# Altium project MEC.PrjPcb (part 1 of 2)
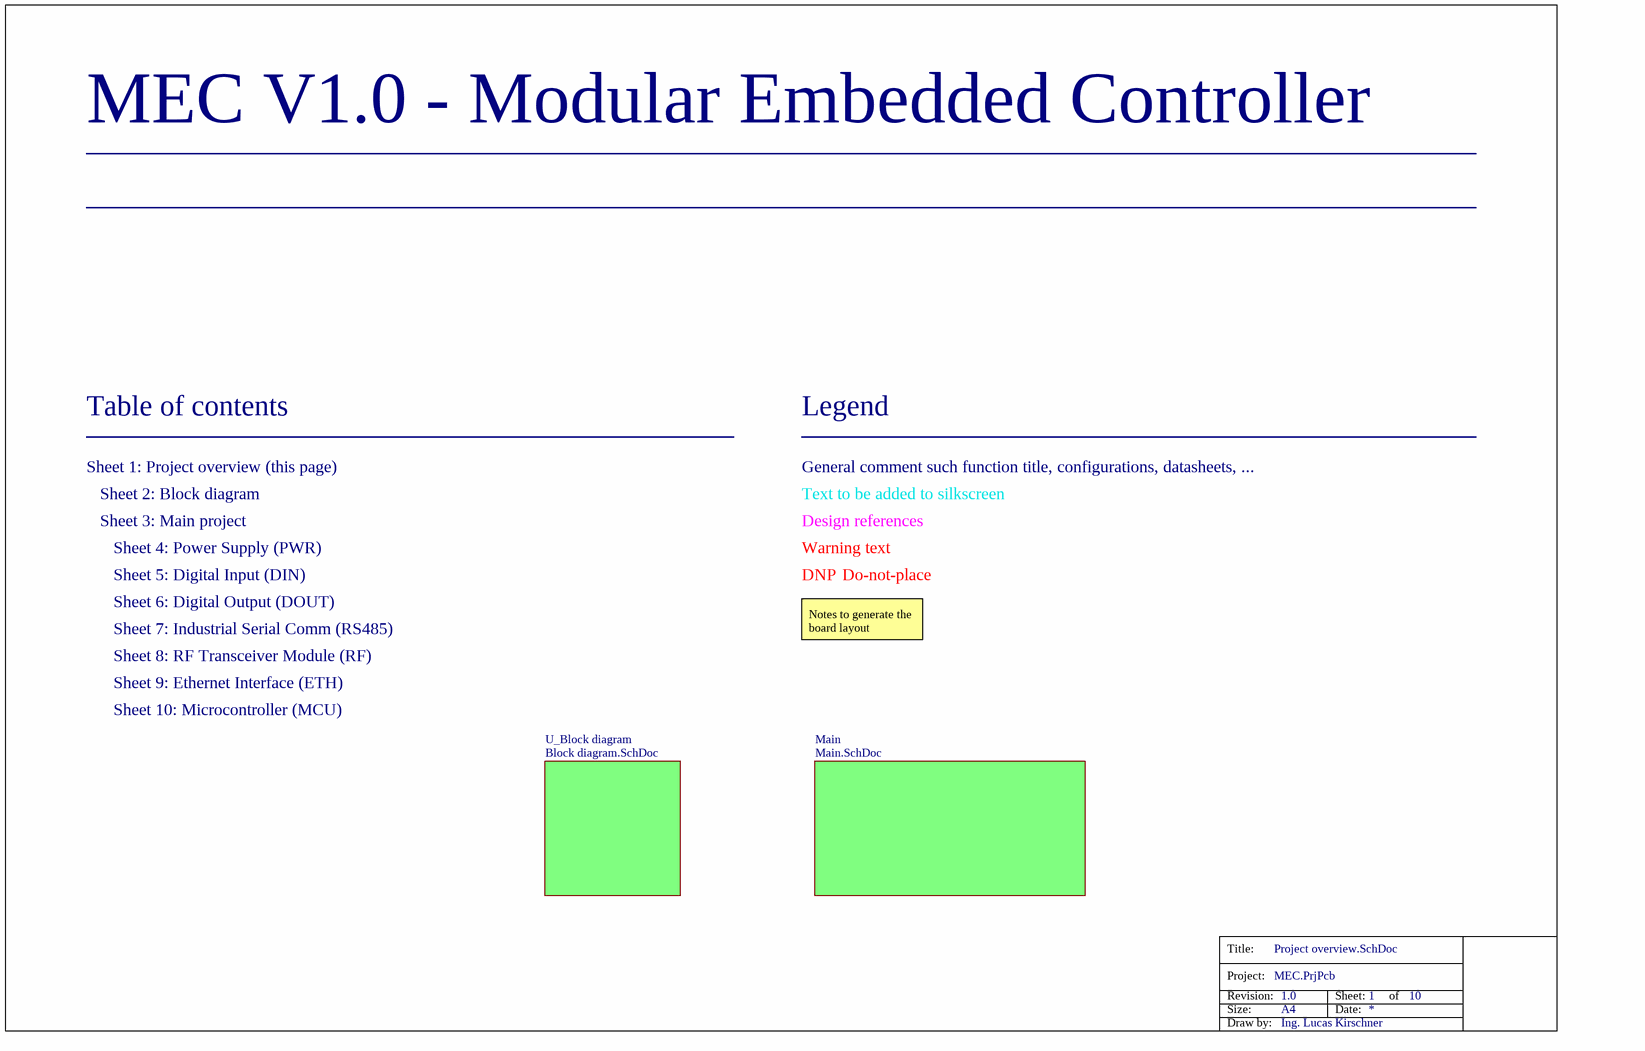
[diagram p0: Project overview.SchDoc]
Author: Ing. Lucas Kirschner; Company: Ing. Prodol; Version: 1.0
10 sheets, 240 parts. Net scope: flat (ports and power ports of the same name join across sheets).
Board file: PCB.PcbDoc
Sheets:
  Project overview.SchDoc
    Main = Main.SchDoc
      U_Microcontroller (MCU) = Microcontroller (MCU).SchDoc
      U_Digital Input (DIN) = Digital Input (DIN).SchDoc
      U_Digital Output (DOUT) = Digital Output (DOUT).SchDoc
      U_Ethernet Interface (ETH) = Ethernet Interface (ETH).SchDoc
      U_Power Supply (PWR) = Power Supply (PWR).SchDoc
      U_Industrial Serial Comm (RS485) = Industrial Serial Comm (RS485).SchDoc
      U_RF Transceiver Module (RF) = RF Transceiver Module (RF).SchDoc
    U_Block diagram = Block diagram.SchDoc

## Sheet Project overview.SchDoc
size A4; SheetNumber: 1; SheetTotal: 10

### Sub-sheets
Main = Main.SchDoc: no entries
U_Block diagram = Block diagram.SchDoc: no entries

### Notes on the sheet
- MEC V1.0 - Modular Embedded Controller
- Table of contents
- Legend
- Sheet 1: Project overview (this page)
- Sheet 2: Block diagram
- General comment such function title, configurations, datasheets, ...
- Text to be added to silkscreen
- Sheet 3: Main project
- Sheet 5: Digital Input (DIN)
- Sheet 4: Power Supply (PWR)
- Warning text
- DNP
- Design references
- Do-not-place
- Sheet 6: Digital Output (DOUT)
- Sheet 7: Industrial Serial Comm (RS485)
- Notes to generate the board layout
- Sheet 8: RF Transceiver Module (RF)
- Sheet 10: Microcontroller (MCU)
- Sheet 9: Ethernet Interface (ETH)
- Title:
- Project:
- Revision:
- Size:
- Draw by:
- A4
- Sheet:
- Date:
- of

## Sheet Main.SchDoc
size A4; SheetNumber: 3; SheetTotal: 10
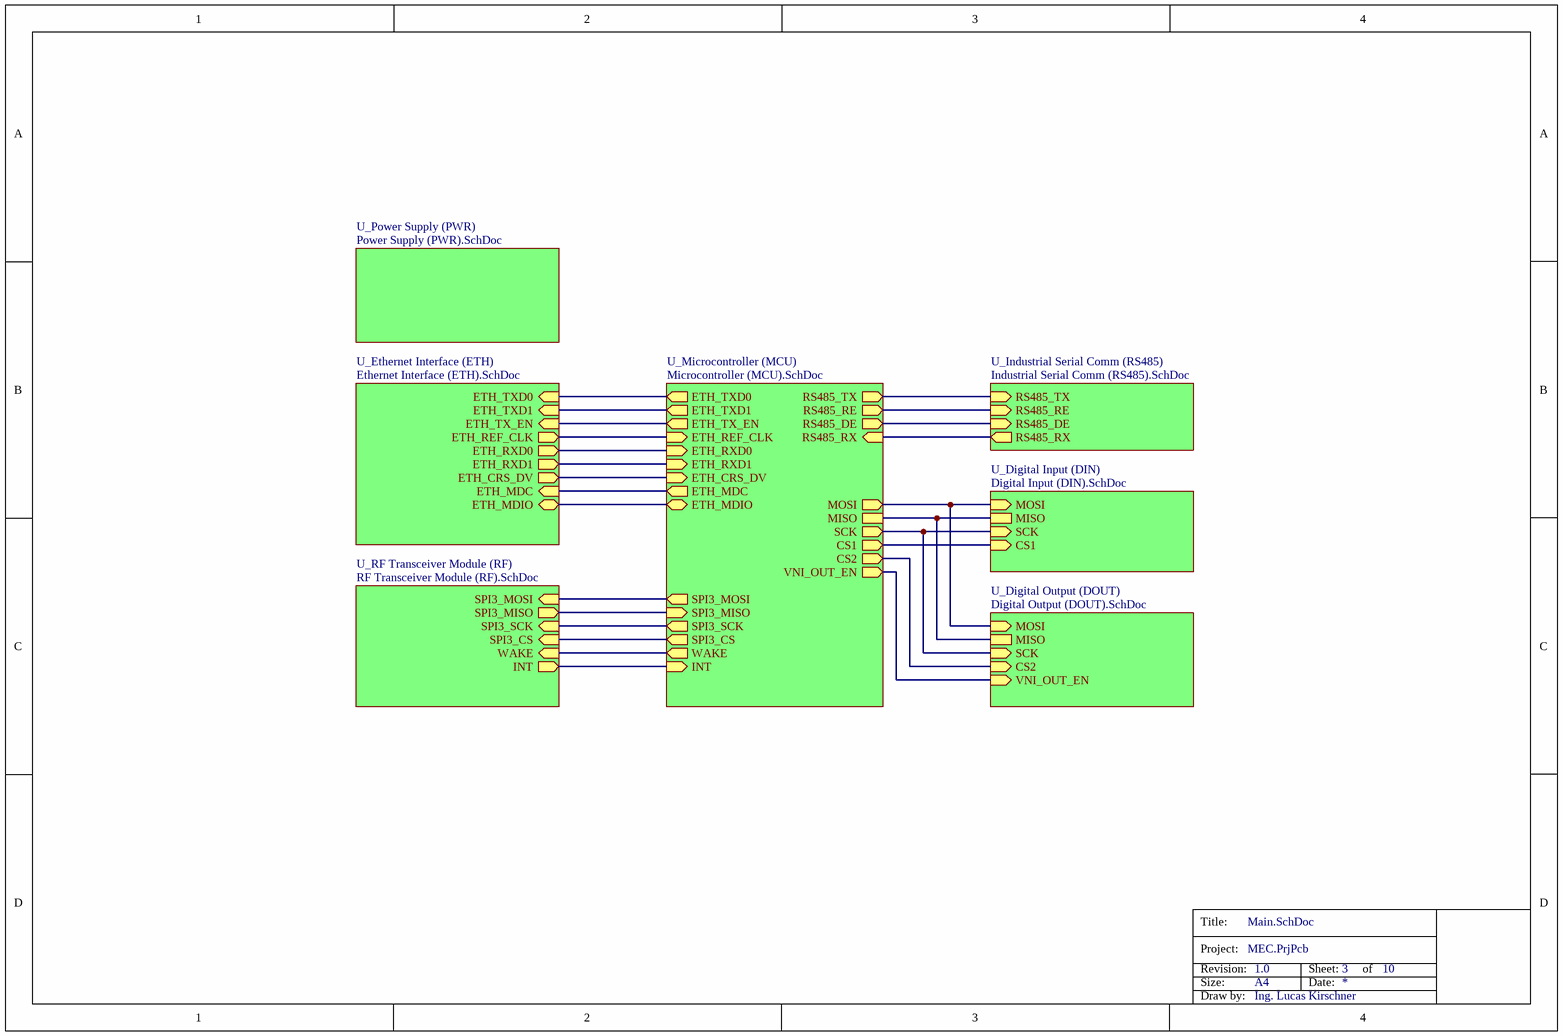
[diagram p1: Main.SchDoc]

### Sub-sheets
U_Digital Input (DIN) = Digital Input (DIN).SchDoc: MOSI (in), SCK (in), CS1 (in), MISO
U_Digital Output (DOUT) = Digital Output (DOUT).SchDoc: VNI_OUT_EN (in), MOSI (in), SCK (in), CS2 (in), MISO
U_Ethernet Interface (ETH) = Ethernet Interface (ETH).SchDoc: ETH_REF_CLK (out), ETH_RXD1 (out), ETH_RXD0 (out), ETH_MDIO (bidir), ETH_MDC (in), ETH_TXD1 (in), ETH_TXD0 (in), ETH_TX_EN (in), ETH_CRS_DV (out)
U_Industrial Serial Comm (RS485) = Industrial Serial Comm (RS485).SchDoc: RS485_TX (in), RS485_RX (out), RS485_RE (in), RS485_DE (in)
U_Microcontroller (MCU) = Microcontroller (MCU).SchDoc: ETH_REF_CLK (in), ETH_RXD1 (in), ETH_RXD0 (in), ETH_MDIO (bidir), ETH_MDC (out), ETH_TXD1 (out), ETH_TXD0 (out), ETH_TX_EN (out), ETH_CRS_DV (in), RS485_RX (in), RS485_TX (out), SPI3_CS (out), SPI3_SCK (out), SPI3_MISO (in), SPI3_MOSI (out), MOSI (out), SCK (out), CS1 (out), MISO, CS2 (out), VNI_OUT_EN (out), INT (in), RS485_RE (out), RS485_DE (out), WAKE (out)
U_Power Supply (PWR) = Power Supply (PWR).SchDoc: no entries
U_RF Transceiver Module (RF) = RF Transceiver Module (RF).SchDoc: SPI3_CS (in), SPI3_SCK (in), SPI3_MISO (out), SPI3_MOSI (in), INT (out), WAKE (in)

### Nets
(unnamed): sheet U_Microcontroller (MCU)/ETH_REF_CLK, sheet U_Ethernet Interface (ETH)/ETH_REF_CLK
(unnamed): sheet U_Microcontroller (MCU)/ETH_RXD1, sheet U_Ethernet Interface (ETH)/ETH_RXD1
(unnamed): sheet U_Microcontroller (MCU)/ETH_RXD0, sheet U_Ethernet Interface (ETH)/ETH_RXD0
(unnamed): sheet U_Microcontroller (MCU)/ETH_MDIO, sheet U_Ethernet Interface (ETH)/ETH_MDIO
(unnamed): sheet U_Microcontroller (MCU)/ETH_MDC, sheet U_Ethernet Interface (ETH)/ETH_MDC
(unnamed): sheet U_Microcontroller (MCU)/ETH_TXD1, sheet U_Ethernet Interface (ETH)/ETH_TXD1
(unnamed): sheet U_Microcontroller (MCU)/ETH_TXD0, sheet U_Ethernet Interface (ETH)/ETH_TXD0
(unnamed): sheet U_Microcontroller (MCU)/ETH_TX_EN, sheet U_Ethernet Interface (ETH)/ETH_TX_EN
(unnamed): sheet U_Microcontroller (MCU)/ETH_CRS_DV, sheet U_Ethernet Interface (ETH)/ETH_CRS_DV
(unnamed): sheet U_Microcontroller (MCU)/RS485_RX, sheet U_Industrial Serial Comm (RS485)/RS485_RX
(unnamed): sheet U_Microcontroller (MCU)/RS485_TX, sheet U_Industrial Serial Comm (RS485)/RS485_TX
(unnamed): sheet U_Microcontroller (MCU)/SPI3_CS, sheet U_RF Transceiver Module (RF)/SPI3_CS
(unnamed): sheet U_Microcontroller (MCU)/SPI3_SCK, sheet U_RF Transceiver Module (RF)/SPI3_SCK
(unnamed): sheet U_Microcontroller (MCU)/SPI3_MISO, sheet U_RF Transceiver Module (RF)/SPI3_MISO
(unnamed): sheet U_Microcontroller (MCU)/SPI3_MOSI, sheet U_RF Transceiver Module (RF)/SPI3_MOSI
(unnamed): sheet U_Microcontroller (MCU)/MOSI, sheet U_Digital Input (DIN)/MOSI, sheet U_Digital Output (DOUT)/MOSI
(unnamed): sheet U_Microcontroller (MCU)/SCK, sheet U_Digital Input (DIN)/SCK, sheet U_Digital Output (DOUT)/SCK
(unnamed): sheet U_Microcontroller (MCU)/CS1, sheet U_Digital Input (DIN)/CS1
(unnamed): sheet U_Microcontroller (MCU)/MISO, sheet U_Digital Input (DIN)/MISO, sheet U_Digital Output (DOUT)/MISO
(unnamed): sheet U_Microcontroller (MCU)/CS2, sheet U_Digital Output (DOUT)/CS2
(unnamed): sheet U_Microcontroller (MCU)/VNI_OUT_EN, sheet U_Digital Output (DOUT)/VNI_OUT_EN
(unnamed): sheet U_Microcontroller (MCU)/INT, sheet U_RF Transceiver Module (RF)/INT
(unnamed): sheet U_Microcontroller (MCU)/RS485_RE, sheet U_Industrial Serial Comm (RS485)/RS485_RE
(unnamed): sheet U_Microcontroller (MCU)/RS485_DE, sheet U_Industrial Serial Comm (RS485)/RS485_DE
(unnamed): sheet U_Microcontroller (MCU)/WAKE, sheet U_RF Transceiver Module (RF)/WAKE

### Notes on the sheet
- Title:
- Project:
- Revision:
- Size:
- A4
- Sheet:
- Date:
- of
- Draw by:

## Sheet Microcontroller (MCU).SchDoc
size A4; SheetNumber: 10; SheetTotal: 10
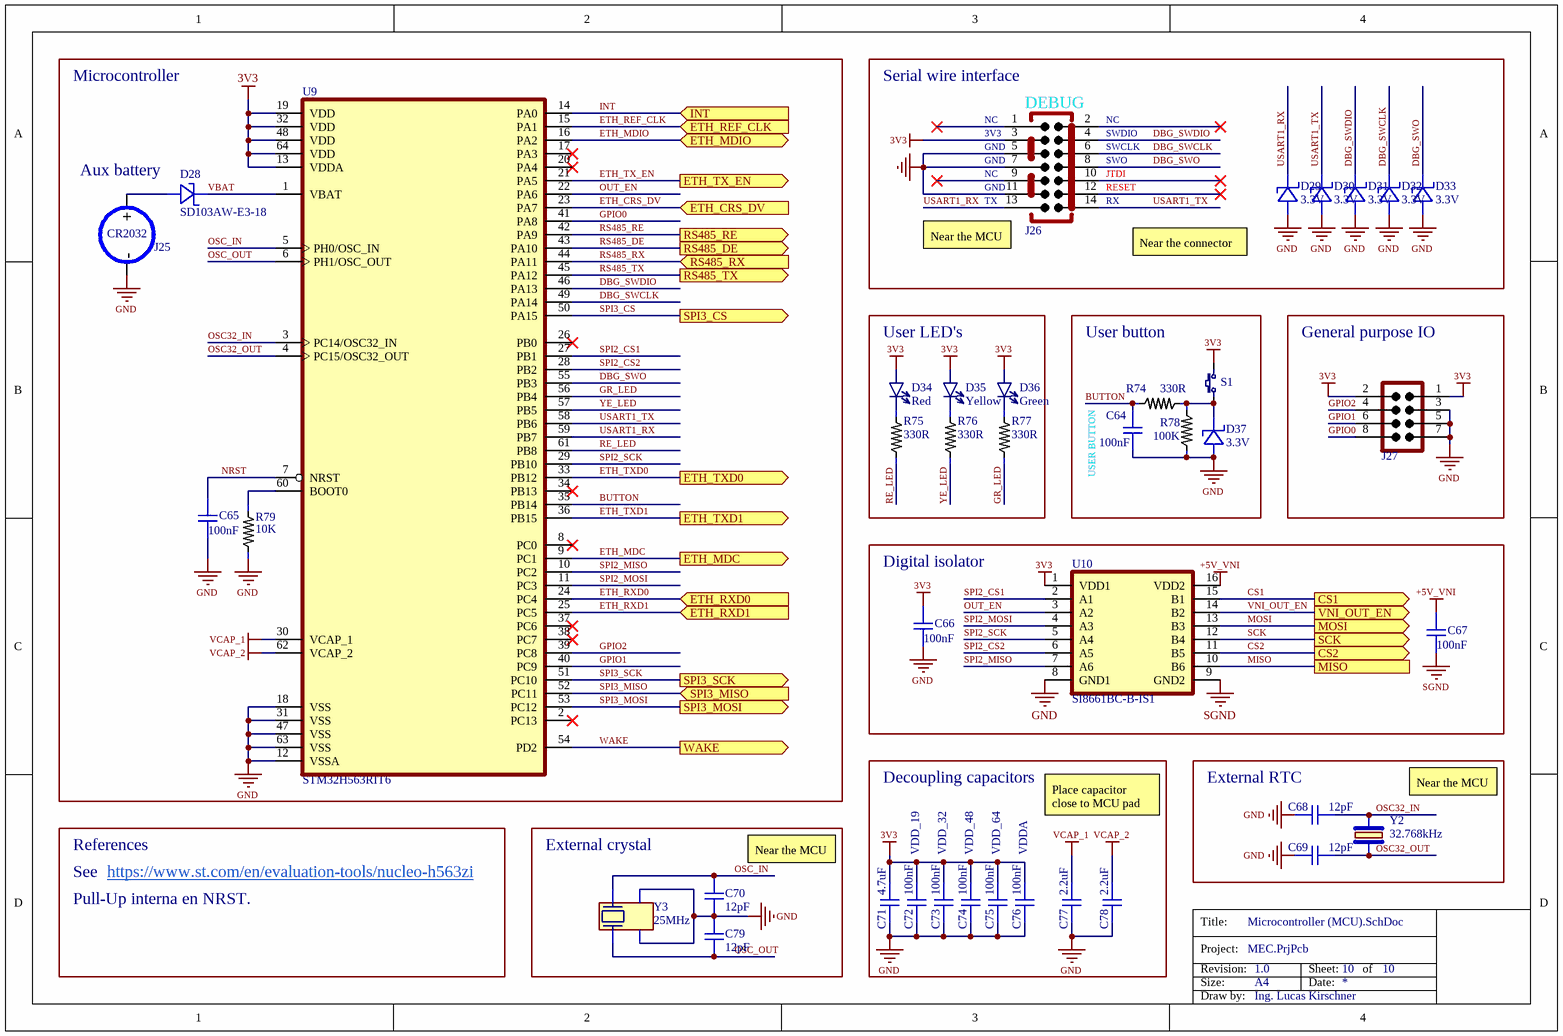
[diagram p2: Microcontroller (MCU).SchDoc]

### Parts
C64  value 100nF  [CAPC1005N]  (hidden comment: Multilayer Ceramic Capacitors)
C65  value 100nF  [CAPC1005N]  (hidden comment: Multilayer Ceramic Capacitors)
C66  value 100nF  [CAPC1005N]  (hidden comment: Multilayer Ceramic Capacitors)
C67  value 100nF  [CAPC1005N]  (hidden comment: Multilayer Ceramic Capacitors)
C68  value 12pF  [CAPC1005N]  (hidden comment: Multilayer Ceramic Capacitors)
C69  value 12pF  [CAPC1005N]  (hidden comment: Multilayer Ceramic Capacitors)
C70  value 12pF  [CAPC1005N]  (hidden comment: Multilayer Ceramic Capacitors)
C71  value 4.7uF  [CAPC1005N]  (hidden comment: Multilayer Ceramic Capacitors)
C72  value 100nF  [CAPC1005N]  (hidden comment: Multilayer Ceramic Capacitors)
C73  value 100nF  [CAPC1005N]  (hidden comment: Multilayer Ceramic Capacitors)
C74  value 100nF  [CAPC1005N]  (hidden comment: Multilayer Ceramic Capacitors)
C75  value 100nF  [CAPC1005N]  (hidden comment: Multilayer Ceramic Capacitors)
C76  value 100nF  [CAPC1005N]  (hidden comment: Multilayer Ceramic Capacitors)
C77  value 2.2uF  [CAPC1005N]  (hidden comment: Multilayer Ceramic Capacitors)
C78  value 2.2uF  [CAPC1005N]  (hidden comment: Multilayer Ceramic Capacitors)
C79  value 12pF  [CAPC1005N]  (hidden comment: Multilayer Ceramic Capacitors)
D28  Part Number: SD103AW-E3-18  [SOD3705X110-2N]  (hidden comment: Schottky Diodes)
D29  value 3.3V  [SOD2512X110N]  (hidden comment: ESD Protection Diodes)
D30  value 3.3V  [SOD2512X110N]  (hidden comment: ESD Protection Diodes)
D31  value 3.3V  [SOD2512X110N]  (hidden comment: ESD Protection Diodes)
D32  value 3.3V  [SOD2512X110N]  (hidden comment: ESD Protection Diodes)
D33  value 3.3V  [SOD2512X110N]  (hidden comment: ESD Protection Diodes)
D34  value Red  [LEDC1608X80N_RED]  (hidden comment: Single Color LED)
D35  value Yellow  [LEDC1608X80N_YELLOW]  (hidden comment: Single Color LED)
D36  value Green  [LEDC1608X80N_GREEN]  (hidden comment: Single Color LED)
D37  value 3.3V  [SOD2512X110N]  (hidden comment: ESD Protection Diodes)
J25  Cell Battery Holders  [CONB_BH_CR2032-2N]  (value not drawn)
J26  Male straight header  [CONH_ML127P-14N]  (value not drawn)
J27  Male straight header  [CONH_ML254P-SMT-8N]  (value not drawn)
R74  value 330R  [RESC1005N]  (hidden comment: Thick Film Resistors)
R75  value 330R  [RESC1005N]  (hidden comment: Thick Film Resistors)
R76  value 330R  [RESC1005N]  (hidden comment: Thick Film Resistors)
R77  value 330R  [RESC1005N]  (hidden comment: Thick Film Resistors)
R78  value 100K  [RESC1005N]  (hidden comment: Thick Film Resistors)
R79  value 10K  [RESC1005N]  (hidden comment: Thick Film Resistors)
S1  Tactile Switches  [PKG3.5X6-2N]  (value not drawn)
U9  Part Number: STM32H563RIT6  [QFP50P1200X1200X160-64N]  (hidden comment: ARM Cortex M33 MCU)
U10  Part Number: SI8661BC-B-IS1  [SOIC127P1030X265-16N]  (hidden comment: Digital Isolators)
Y2  value 32.768kHz  [XTAL3215]  (hidden comment: Crystal)
Y3  value 25MHz  [XTAL3225]  (hidden comment: Crystal)

### Blocks framed on the sheet
User LED's: D34-D36 R75-R77
User button: C64 D37 R74 R78 S1
General purpose IO: J27
Digital isolator: C66 C67 U10
Decoupling capacitors: C71-C78
External RTC: C68 C69 Y2
External crystal: C70 C79 Y3

### Ports
CS1 (out, see Main[3C], Digital Input (DIN)[1C]), CS2 (out, see Main[3C], Digital Output (DOUT)[1C]), ETH_CRS_DV (in, see Main[2B], Ethernet Interface (ETH)[2B]), ETH_MDC (out, see Main[2B], Ethernet Interface (ETH)[2B]), ETH_MDIO (bidir, see Main[2B], Ethernet Interface (ETH)[2B]), ETH_REF_CLK (in, see Main[2B], Ethernet Interface (ETH)[2B]), ETH_RXD0 (in, see Main[2B], Ethernet Interface (ETH)[2B]), ETH_RXD1 (in, see Main[2B], Ethernet Interface (ETH)[2B]), ETH_TX_EN (out, see Main[2B], Ethernet Interface (ETH)[2B]), ETH_TXD0 (out, see Main[2B], Ethernet Interface (ETH)[2A]), ETH_TXD1 (out, see Main[2B], Ethernet Interface (ETH)[2B]), INT (in, see Main[2C], RF Transceiver Module (RF)[1B]), MISO (see Main[3C], Digital Input (DIN)[1C], Digital Output (DOUT)[1C]), MOSI (out, see Main[3B], Digital Input (DIN)[1C], Digital Output (DOUT)[1C]), RS485_DE (out, see Main[3B], Industrial Serial Comm (RS485)[1B]), RS485_RE (out, see Main[3B], Industrial Serial Comm (RS485)[1B]), RS485_RX (in, see Main[3B], Industrial Serial Comm (RS485)[1B]), RS485_TX (out, see Main[3B], Industrial Serial Comm (RS485)[1B]), SCK (out, see Main[3C], Digital Input (DIN)[1C], Digital Output (DOUT)[1C]), SPI3_CS (out, see Main[2C], RF Transceiver Module (RF)[2B]), SPI3_MISO (in, see Main[2C], RF Transceiver Module (RF)[2B]), SPI3_MOSI (out, see Main[2C], RF Transceiver Module (RF)[1B]), SPI3_SCK (out, see Main[2C], RF Transceiver Module (RF)[1B]), VNI_OUT_EN (out, see Main[3C], Digital Output (DOUT)[2B]), WAKE (out, see Main[2C], RF Transceiver Module (RF)[1B])

### Nets
3V3: C66.1 C71.1 C72.1 C73.1 C74.1 C75.1 C76.1 D34.A D35.A D36.A J26.3 J27.1 J27.2 S1.2 U9.13(VDDA) U9.19(VDD) U9.32(VDD) U9.48(VDD) U9.64(VDD) U10.1(VDD1)
+5V_VNI: C67.1 U10.16(VDD2)
GND: C64.2 C65.2 C66.2 C68.2 C69.2 C70.2 C71.2 C72.2 C73.2 C74.2 C75.2 C76.2 C77.2 C78.2 C79.1 D29.A D30.A D31.A D32.A D33.A D37.A J25.1(-) J26.5 J26.7 J26.11 J27.3 J27.5 J27.7 R78.1 R79.1 U9.12(VSSA) U9.18(VSS) U9.31(VSS) U9.47(VSS) U9.63(VSS) U10.8(GND1) Y3.2(GND) Y3.4(GND)
SGND: C67.2 U10.9(GND2)
VCAP_1: C77.1 U9.30(VCAP_1)
VCAP_2: C78.1 U9.62(VCAP_2)
BUTTON: C64.1 R74.1 U9.35(PB14)
CS1: U10.15(B1) ; port CS1
CS2: U10.11(B5) ; port CS2
DBG_SWCLK: D32.C J26.6 U9.49(PA14)
DBG_SWDIO: D31.C J26.4 U9.46(PA13)
DBG_SWO: D33.C J26.8 U9.55(PB3)
ETH_CRS_DV: U9.23(PA7) ; port ETH_CRS_DV
ETH_MDC: U9.9(PC1) ; port ETH_MDC
ETH_MDIO: U9.16(PA2) ; port ETH_MDIO
ETH_REF_CLK: U9.15(PA1) ; port ETH_REF_CLK
ETH_RXD0: U9.24(PC4) ; port ETH_RXD0
ETH_RXD1: U9.25(PC5) ; port ETH_RXD1
ETH_TX_EN: U9.21(PA5) ; port ETH_TX_EN
ETH_TXD0: U9.33(PB12) ; port ETH_TXD0
ETH_TXD1: U9.36(PB15) ; port ETH_TXD1
GPIO0: J27.8 U9.41(PA8)
GPIO1: J27.6 U9.40(PC9)
GPIO2: J27.4 U9.39(PC8)
GR_LED: R77.1 U9.56(PB4)
INT: U9.14(PA0) ; port INT
MISO: U10.10(B6) ; port MISO
MOSI: U10.13(B3) ; port MOSI
NRST: C65.1 U9.7(NRST)
OSC32_IN: C68.1 U9.3(PC14/OSC32_IN) Y2.2(CRYSTAL)
OSC32_OUT: C69.1 U9.4(PC15/OSC32_OUT) Y2.1(CRYSTAL)
OSC_IN: C70.1 U9.5(PH0/OSC_IN) Y3.1(IN/OUT)
OSC_OUT: C79.2 U9.6(PH1/OSC_OUT) Y3.3(OUT/IN)
OUT_EN: U9.22(PA6) U10.3(A2)
RE_LED: R75.1 U9.61(PB8)
RS485_DE: U9.43(PA10) ; port RS485_DE
RS485_RE: U9.42(PA9) ; port RS485_RE
RS485_RX: U9.44(PA11) ; port RS485_RX
RS485_TX: U9.45(PA12) ; port RS485_TX
SCK: U10.12(B4) ; port SCK
SPI2_CS1: U9.27(PB1) U10.2(A1)
SPI2_CS2: U9.28(PB2) U10.6(A5)
SPI2_MISO: U9.10(PC2) U10.7(A6)
SPI2_MOSI: U9.11(PC3) U10.4(A3)
SPI2_SCK: U9.29(PB10) U10.5(A4)
SPI3_CS: U9.50(PA15) ; port SPI3_CS
SPI3_MISO: U9.52(PC11) ; port SPI3_MISO
SPI3_MOSI: U9.53(PC12) ; port SPI3_MOSI
SPI3_SCK: U9.51(PC10) ; port SPI3_SCK
USART1_RX: D29.C J26.13 U9.59(PB7)
USART1_TX: D30.C J26.14 U9.58(PB6)
VBAT: D28.C U9.1(VBAT)
VNI_OUT_EN: U10.14(B2) ; port VNI_OUT_EN
WAKE: U9.54(PD2) ; port WAKE
YE_LED: R76.1 U9.57(PB5)
NetD28_A: D28.A J25.2(+)
NetD34_C: D34.C R75.2
NetD35_C: D35.C R76.2
NetD36_C: D36.C R77.2
NetD37_C: D37.C R74.2 R78.2 S1.1
NetR79_2: R79.2 U9.60(BOOT0)

Not connected (* = marked no-connect by the designer): J26 1* 2* 9* 10* 12*; U9 2(PC13)* 8(PC0)* 17(PA3)* 20(PA4)* 26(PB0)* 34(PB13)* 37(PC6)* 38(PC7)*

### Notes on the sheet
- Microcontroller
- (near J26) Serial wire interface
- (near J26) DEBUG
- Aux battery
- (near J26) NC
- (near J26) GND
- (near J26) 3V3
- (near J26) SWO
- (near J26) SWCLK
- (near J26) SWDIO
- (near J26) JTDI
- (near J26) Near the MCU
- (near J26) TX
- (near J26) RX
- (near J26) RESET
- Near the connector
- USER BUTTON
- (near Y2) Near the MCU
- References
- VDD_19
- VDD_32
- VDD_48
- VDD_64
- VDDA
- Place capacitor close to MCU pad
- See
- Pull-Up interna en NRST.
- https://www.st.com/en/evaluation-tools/nucleo-h563zi
- Near the MCU
- Title:
- Project:
- Revision:
- Size:
- A4
- Sheet:
- Date:
- of
- Draw by:
- (in symbol J-CR2032-H-SMT) CR2032

### Library data of the parts
C64-C67 C72-C76 = C-MLCC-100nF-50V-10%-0402: Multilayer Ceramic Capacitors MLCC - SMD/SMT 50 V 0.1uF X7R 0402 10%; Part Number: CC0402KRX5R9BB104; Manufacturer: YAGEO; Mounting Type: SMT; Mouser Part #: 603-CC402KRX5R9BB104; Digikey Part #: 311-3342-1-ND; JLCPCB Part #: C105882
C68-C70 C79 = C-MLCC-12pF-50V-10%-0402: Multilayer Ceramic Capacitors MLCC - SMD/SMT 50 V 12 pF C0G 0402 1%; Part Number: CC0402FRNPO9BN120; Manufacturer: YAGEO; Mounting Type: SMT; Mouser Part #: 603-CC402FRNPO9BN120; Digikey Part #: 311-1641-1-ND; JLCPCB Part #: C326662
C71 = C-MLCC-4.7uF-10V-10%-0402: Multilayer Ceramic Capacitors MLCC - SMD/SMT 10V 4.7uF X5R 0402 10% HI CV; Part Number: CC0402KRX5R6BB475; Manufacturer: YAGEO; Mounting Type: SMT; Mouser Part #: 603-CC0402KR5R6BB475; Digikey Part #: 13-CC0402KRX5R6BB475CT-ND; JLCPCB Part #: C326586
C77 C78 = C-MLCC-2.2uF-25V-10%-0402: Multilayer Ceramic Capacitors MLCC - SMD/SMT 25V 2.2uF X5R 0402 10% HI CV; Part Number: CC0402KRX5R8BB225; Manufacturer: YAGEO; Mounting Type: SMT; Mouser Part #: 603-CC0402KRX5R8B225; Digikey Part #: 13-CC0402KRX5R8BB225CT-ND; JLCPCB Part #: C723363
D28 = D-SCH-350mA-40V-SOD123: Schottky Diodes & Rectifiers 350mA 40V SOD123; Manufacturer: Vishay Semiconductors; Mounting Type: SMT; Mouser Part #: 78-SD103AW-E3-18; Digikey Part #: SD103AW-E3-18CT-ND; JLCPCB Part #: C181204
D29-D33 D37 = D-TVS-36W-3.3V-SOD323: ESD Protection Diodes / TVS Diodes UNIDIRECTIONAL 3.3V ESD PR; Manufacturer: onsemi; Part Number: ESD7351HT1G; Mounting Type: SMT; Mouser Part #: 863-ESD7351HT1G; Digikey Part #: ESD7351HT1GOSCT-ND; JLCPCB Part #: C19829399
D34 = D-LED-RED-2V-20mA-0603: Standard Single Color LEDs 0603 Red; Part Number: LTST-C190KRKT; Manufacturer: LITEON; Mounting Type: SMT; Mouser Part #: 859-LTST-C190KRKT; Digikey Part #: 160-1436-1-ND; JLCPCB Part #: C94869
D35 = D-LED-YELLOW-2V-20mA-0603: Standard Single Color LEDs 0603 Yellow; Part Number: LTST-C190KSKT; Manufacturer: LITEON; Mounting Type: SMT; Mouser Part #: 859-LTST-C190KSKT; Digikey Part #: 160-1437-1-ND; JLCPCB Part #: C125095
D36 = D-LED-GREEN-2V-20mA-0603: Standard Single Color LEDs 0603 Green; Part Number: LTST-C190KGKT; Manufacturer: LITEON; Mounting Type: SMT; Mouser Part #: 859-LTST-C190KGKT; Digikey Part #: 160-1435-1-ND; JLCPCB Part #: C125094
J25 = J-CR2032-H-SMT: Coin Cell Battery Holders CR2032; Part Number: 1061; Manufacturer: Keystone Electronics; Mounting Type: SMT; Mouser Part #: 534-1061; Digikey Part #: 36-1061-ND; JLCPCB Part #: C238070
J26 = J-14-1P27-HDR-M-SH-SMT: Male straight header, 2 row, 14 positions, 1.27mm pitch, SMD; Manufacturer: SAMTEC; Part Number: FTSH-107-01-F-DV-K; Mounting Type: SMT; Mouser Part #: 200-FTSH10701FDVK; Digikey Part #: 612-FTSH-107-01-F-DV-K-ND; JLCPCB Part #: C7465995
J27 = J-8-2P54-HDR-M-VERT-SMT: Male straight header, 2 row, 8 positions, 2.54mm pitch, SMD; Part Number: 95278-101-08LF; Manufacturer: Amphenol FCI; Mounting Type: SMT; Mouser Part #: 649-95278-101-08LF; Digikey Part #: 609-5752-ND; JLCPCB Part #: C192300
R74-R77 = R-THICK-330R-62.5mW-1%-0402: Thick Film Resistors - SMD General Purpose Chip Resistor 0402, 330Ohms, 1%, 1/16W; Part Number: RC0402FR-07330RL; Manufacturer: YAGEO; Mounting Type: SMT; Mouser Part #: 603-RC0402FR-07330RL; Digikey Part #: 311-330LRCT-ND; JLCPCB Part #: C105875
R78 = R-THICK-100K-62.5mW-1%-0402: Thick Film Resistors - SMD General Purpose Chip Resistor 0402, 100kOhms, 1%, 1/16W; Part Number: RC0402FR-07100KL; Manufacturer: YAGEO; Mounting Type: SMT; Mouser Part #: 603-RC0402FR-07100KL; Digikey Part #: 311-100KLRCT-ND; JLCPCB Part #: C60491
R79 = R-THICK-10K-62.5mW-1%-0402: Thick Film Resistors - SMD General Purpose Chip Resistor 0402, 10kOhms, 1%, 1/16W; Part Number: RC0402FR-0710KL; Manufacturer: YAGEO; Mounting Type: SMT; Mouser Part #: 603-RC0402FR-0710KL; Digikey Part #: 311-10.0KLRCT-ND; JLCPCB Part #: C60490
S1 = S-TACT-NO-6x3.5-SMT: Tactile Switches SMD OFF - (ON); Manufacturer: TE Connectivity; Part Number: FSMSM; Mounting Type: SMT; Mouser Part #: 506-FSMSM; Digikey Part #: 450-1140-ND; JLCPCB Part #: C3012022
U9 = U-STM32H563RI: ARM Microcontrollers - MCU Arm Cortex-M33 32-bit 250 MHz 2 Mbytes Flash 640KB RAM I3C, DCMI, Ethernet, SMPS; Manufacturer: STMicroelectronics; Mounting Type: SMT; Mouser Part #: 511-STM32H563RIT6; Digikey Part #: 497-STM32H563RIT6-ND; JLCPCB Part #: C20619634
U10 = U-SI8661BC-B-IS1: Digital Isolators 3.75 kV 5 forward & 1 reverse 6-channel isolator; Manufacturer: Skyworks; Mounting Type: SMT; Mouser Part #: 634-SI8661BC-B-IS1; Digikey Part #: 336-2120-5-ND; JLCPCB Part #: C528656
Y2 = Y-XTAL-32.768kHz-12pF-20ppm-3215-SMT: Crystals 32.768KHz 20ppm 12.5pF -40C +85C; Part Number: ECS-.327-12.5-34B-TR; Manufacturer: ECS; Mounting Type: SMT; Mouser Part #: 520-327-12.5-34B; Digikey Part #: 50-ECS-.327-12.5-34B-TRCT-ND; JLCPCB Part #: C32346
Y3 = Y-XTAL-25MHz-12pF-20ppm-3225-SMT: Crystals 25MHz 12pF 20ppm -40C +125C; Manufacturer: ECS; Part Number: ECS-250-12-33Q-JES-TR; Mounting Type: SMT; Mouser Part #: 520-250-12-33Q-JEST; Digikey Part #: XC2151CT-ND; JLCPCB Part #: C91750

## Sheet Digital Input (DIN).SchDoc
size A4; SheetNumber: 5; SheetTotal: 10
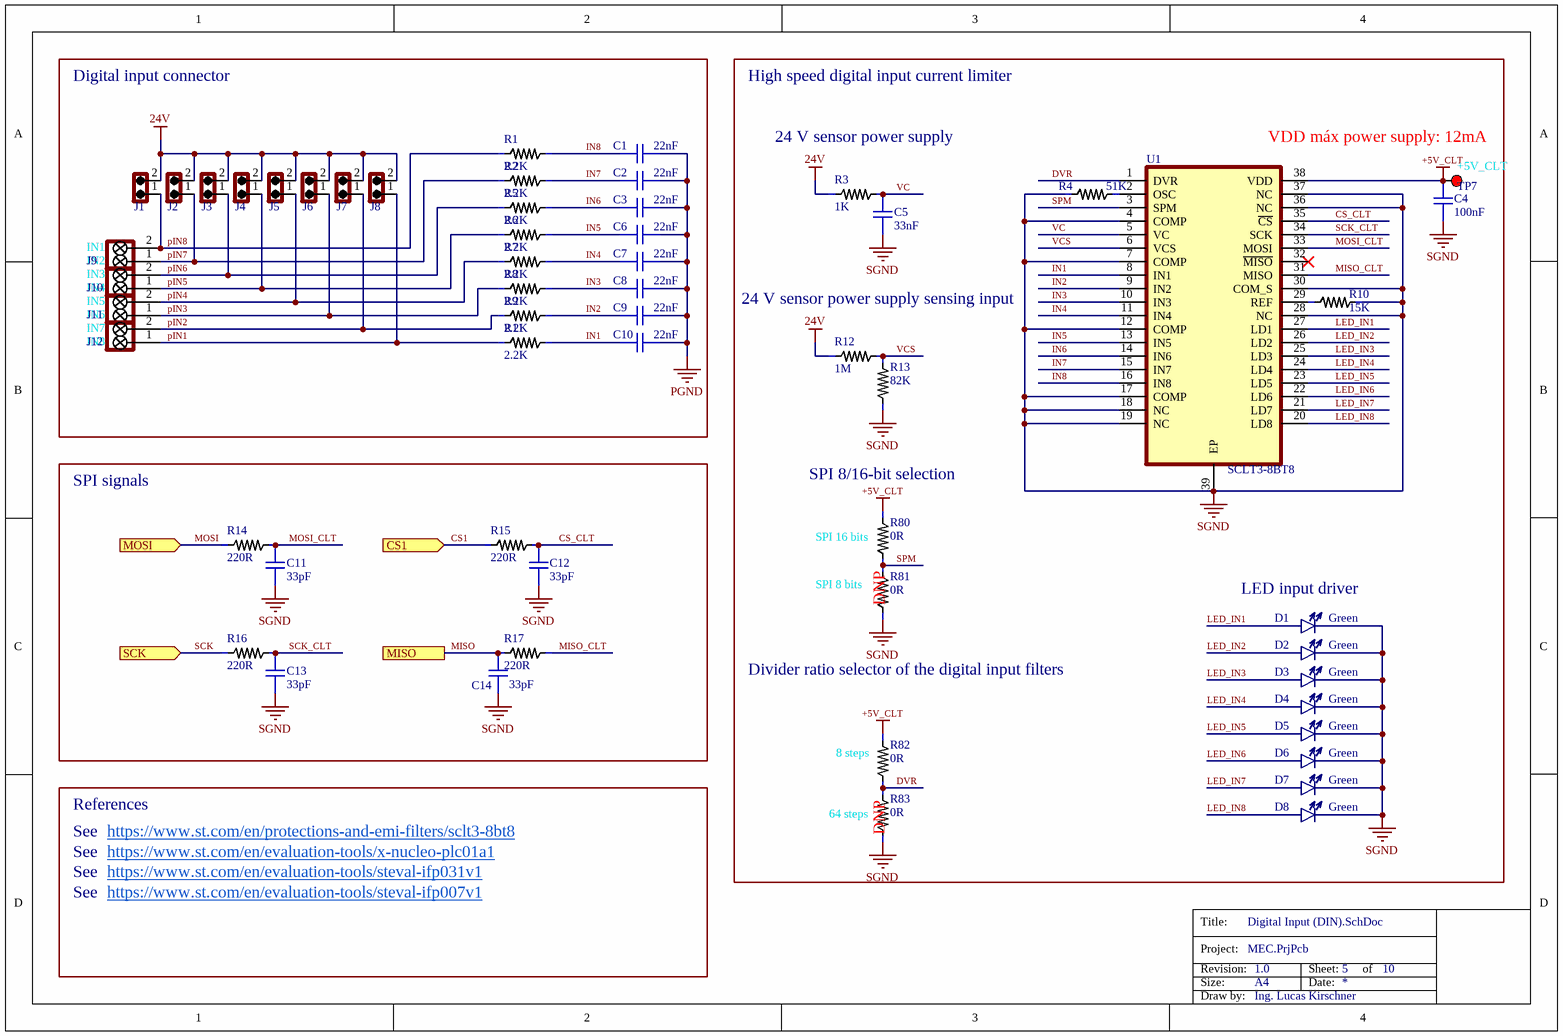
[diagram p3: Digital Input (DIN).SchDoc]

### Parts
C1  value 22nF  [CAPC2012N]  (hidden comment: Multilayer Ceramic Capacitors)
C2  value 22nF  [CAPC2012N]  (hidden comment: Multilayer Ceramic Capacitors)
C3  value 22nF  [CAPC2012N]  (hidden comment: Multilayer Ceramic Capacitors)
C4  value 100nF  [CAPC1005N]  (hidden comment: Multilayer Ceramic Capacitors)
C5  value 33nF  [CAPC2012N]  (hidden comment: Multilayer Ceramic Capacitors)
C6  value 22nF  [CAPC2012N]  (hidden comment: Multilayer Ceramic Capacitors)
C7  value 22nF  [CAPC2012N]  (hidden comment: Multilayer Ceramic Capacitors)
C8  value 22nF  [CAPC2012N]  (hidden comment: Multilayer Ceramic Capacitors)
C9  value 22nF  [CAPC2012N]  (hidden comment: Multilayer Ceramic Capacitors)
C10  value 22nF  [CAPC2012N]  (hidden comment: Multilayer Ceramic Capacitors)
C11  value 33pF  [CAPC1005N]  (hidden comment: Multilayer Ceramic Capacitors)
C12  value 33pF  [CAPC1005N]  (hidden comment: Multilayer Ceramic Capacitors)
C13  value 33pF  [CAPC1005N]  (hidden comment: Multilayer Ceramic Capacitors)
C14  value 33pF  [CAPC1005N]  (hidden comment: Multilayer Ceramic Capacitors)
D1  value Green  [LEDC1608X80N_GREEN]  (hidden comment: Single Color LED)
D2  value Green  [LEDC1608X80N_GREEN]  (hidden comment: Single Color LED)
D3  value Green  [LEDC1608X80N_GREEN]  (hidden comment: Single Color LED)
D4  value Green  [LEDC1608X80N_GREEN]  (hidden comment: Single Color LED)
D5  value Green  [LEDC1608X80N_GREEN]  (hidden comment: Single Color LED)
D6  value Green  [LEDC1608X80N_GREEN]  (hidden comment: Single Color LED)
D7  value Green  [LEDC1608X80N_GREEN]  (hidden comment: Single Color LED)
D8  value Green  [LEDC1608X80N_GREEN]  (hidden comment: Single Color LED)
J1  Male straight header  [CONH_ML254P-2N]  (value not drawn)
J2  Male straight header  [CONH_ML254P-2N]  (value not drawn)
J3  Male straight header  [CONH_ML254P-2N]  (value not drawn)
J4  Male straight header  [CONH_ML254P-2N]  (value not drawn)
J5  Male straight header  [CONH_ML254P-2N]  (value not drawn)
J6  Male straight header  [CONH_ML254P-2N]  (value not drawn)
J7  Male straight header  [CONH_ML254P-2N]  (value not drawn)
J8  Male straight header  [CONH_ML254P-2N]  (value not drawn)
J9  Terminal Blocks  [CONB_FIX508P-2N]  (value not drawn)
J10  Terminal Blocks  [CONB_FIX508P-2N]  (value not drawn)
J11  Terminal Blocks  [CONB_FIX508P-2N]  (value not drawn)
J12  Terminal Blocks  [CONB_FIX508P-2N]  (value not drawn)
R1  value 2.2K  [RESC2012N]  (hidden comment: Thick Film Resistors)
R2  value 2.2K  [RESC2012N]  (hidden comment: Thick Film Resistors)
R3  value 1K  [RESC2012N]  (hidden comment: Thick Film Resistors)
R4  value 51K  [RESC1005N]  (hidden comment: Thick Film Resistors)
R5  value 2.2K  [RESC2012N]  (hidden comment: Thick Film Resistors)
R6  value 2.2K  [RESC2012N]  (hidden comment: Thick Film Resistors)
R7  value 2.2K  [RESC2012N]  (hidden comment: Thick Film Resistors)
R8  value 2.2K  [RESC2012N]  (hidden comment: Thick Film Resistors)
R9  value 2.2K  [RESC2012N]  (hidden comment: Thick Film Resistors)
R10  value 15K  [RESC1005N]  (hidden comment: Thick Film Resistors)
R11  value 2.2K  [RESC2012N]  (hidden comment: Thick Film Resistors)
R12  value 1M  [RESC2012N]  (hidden comment: Thick Film Resistors)
R13  value 82K  [RESC2012N]  (hidden comment: Thick Film Resistors)
R14  value 220R  [RESC1005N]  (hidden comment: Thick Film Resistors)
R15  value 220R  [RESC1005N]  (hidden comment: Thick Film Resistors)
R16  value 220R  [RESC1005N]  (hidden comment: Thick Film Resistors)
R17  value 220R  [RESC1005N]  (hidden comment: Thick Film Resistors)
R80  value 0R  [RESC1005N]  (hidden comment: Thick Film Resistors)
R81  value 0R  [RESC1005N]  (hidden comment: Thick Film Resistors)  (no BOM)
R82  value 0R  [RESC1005N]  (hidden comment: Thick Film Resistors)
R83  value 0R  [RESC1005N]  (hidden comment: Thick Film Resistors)  (no BOM)
TP7  Test point  [TP-1MM]  (value not drawn)  (no BOM)
U1  Part Number: SCLT3-8BT8  [SOP50P640X110-39N]  (hidden comment: I/O Controller Interface)

### Blocks framed on the sheet
Digital input connector: C1-C3 C6-C10 J1-J12 R1 R2 R5-R9 R11
SPI signals: C11-C14 R14-R17

### Ports
CS1 (in, see Main[3C], Microcontroller (MCU)[4C]), MISO (see Main[3C], Digital Output (DOUT)[1C], Microcontroller (MCU)[4C]), MOSI (in, see Main[3B], Digital Output (DOUT)[1C], Microcontroller (MCU)[4C]), SCK (in, see Main[3C], Digital Output (DOUT)[1C], Microcontroller (MCU)[4C])

### Nets
24V: J1.2 J2.2 J3.2 J4.2 J5.2 J6.2 J7.2 J8.2 R3.1 R12.1
+5V_CLT: C4.1 R80.2 R82.2 TP7.1 U1.38(VDD)
PGND: C1.2 C2.2 C3.2 C6.2 C7.2 C8.2 C9.2 C10.2
SGND: C4.2 C5.2 C11.2 C12.2 C13.2 C14.2 D1.C D2.C D3.C D4.C D5.C D6.C D7.C D8.C R4.1 R10.2 R13.1 R81.1 R83.1 U1.4(COMP) U1.7(COMP) U1.12(COMP) U1.17(COMP) U1.18(NC) U1.19(NC) U1.28(NC) U1.30(COM_S) U1.36(NC) U1.37(NC) U1.39(EP)
CS1: R15.1 ; port CS1
CS_CLT: C12.1 R15.2 U1.35(~{CS})
DVR: R82.1 R83.2 U1.1(DVR)
IN1: C10.1 R11.2 U1.8(IN1)
IN2: C9.1 R9.2 U1.9(IN2)
IN3: C8.1 R8.2 U1.10(IN3)
IN4: C7.1 R7.2 U1.11(IN4)
IN5: C6.1 R6.2 U1.13(IN5)
IN6: C3.1 R5.2 U1.14(IN6)
IN7: C2.1 R2.2 U1.15(IN7)
IN8: C1.1 R1.2 U1.16(IN8)
LED_IN1: D1.A U1.27(LD1)
LED_IN2: D2.A U1.26(LD2)
LED_IN3: D3.A U1.25(LD3)
LED_IN4: D4.A U1.24(LD4)
LED_IN5: D5.A U1.23(LD5)
LED_IN6: D6.A U1.22(LD6)
LED_IN7: D7.A U1.21(LD7)
LED_IN8: D8.A U1.20(LD8)
MISO: C14.1 R17.1 ; port MISO
MISO_CLT: R17.2 U1.31(MISO)
MOSI: R14.1 ; port MOSI
MOSI_CLT: C11.1 R14.2 U1.33(MOSI)
pIN1: J8.1 J12.1 R11.1
pIN2: J7.1 J12.2 R9.1
pIN3: J6.1 J11.1 R8.1
pIN4: J5.1 J11.2 R7.1
pIN5: J4.1 J10.1 R6.1
pIN6: J3.1 J10.2 R5.1
pIN7: J2.1 J9.1 R2.1
pIN8: J1.1 J9.2 R1.1
SCK: R16.1 ; port SCK
SCK_CLT: C13.1 R16.2 U1.34(SCK)
SPM: R80.1 R81.2 U1.3(SPM)
VC: C5.1 R3.2 U1.5(VC)
VCS: R12.2 R13.2 U1.6(VCS)
NetR4_2: R4.2 U1.2(OSC)
NetR10_1: R10.1 U1.29(REF)

Not connected (* = marked no-connect by the designer): U1 32(~{MISO})*

### Notes on the sheet
- High speed digital input current limiter
- 24 V sensor power supply
- VDD máx power supply: 12mA
- (near TP7) +5V_CLT
- IN1
- IN2
- IN3
- IN4
- IN5
- 24 V sensor power supply sensing input
- IN6
- IN7
- IN8
- (near R80) SPI 8/16-bit selection
- (near R80) SPI 16 bits
- (near R81) SPI 8 bits
- (near R81) DNP
- (near D1) LED input driver
- Divider ratio selector of the digital input filters
- (near R82) 8 steps
- References
- See
- https://www.st.com/en/protections-and-emi-filters/sclt3-8bt8
- (near R83) 64 steps
- (near R83) DNP
- https://www.st.com/en/evaluation-tools/x-nucleo-plc01a1
- https://www.st.com/en/evaluation-tools/steval-ifp031v1
- https://www.st.com/en/evaluation-tools/steval-ifp007v1
- Title:
- Project:
- Revision:
- Size:
- A4
- Sheet:
- Date:
- of
- Draw by:

### Library data of the parts
C1-C3 C6-C10 = C-MLCC-22nF-100V-10%-0805: Multilayer Ceramic Capacitors MLCC - SMD/SMT 100 V 0.022 uF X7R 0805 10%; Part Number: CC0805KRX7R0BB223; Manufacturer: YAGEO; Mounting Type: SMT; Mouser Part #: 603-CC805KRX7R0BB223; Digikey Part #: 311-1473-1-ND; JLCPCB Part #: C107137
C4 = C-MLCC-100nF-50V-10%-0402: as C64 on sheet Microcontroller (MCU); Mounting Type: SMT; Mouser Part #: 603-CC402KRX5R9BB104; Digikey Part #: 311-3342-1-ND; JLCPCB Part #: C105882
C5 = C-MLCC-33nF-100V-10%-0805: Multilayer Ceramic Capacitors MLCC - SMD/SMT 100 V 0.033 uF X7R 0805 10%; Part Number: CC0805KKX7R0BB333; Manufacturer: YAGEO; Mounting Type: SMT; Mouser Part #: 603-CC805KKX7R0BB333; Digikey Part #: 311-1875-1-ND; JLCPCB Part #: C327114
C11-C14 = C-MLCC-33pF-50V-10%-0402: Multilayer Ceramic Capacitors MLCC - SMD/SMT 50 V 33 pF C0G 0402 1%; Part Number: CC0402KRNPO9BN330; Manufacturer: YAGEO; Mounting Type: SMT; Mouser Part #: 603-CC0402KRNP9BN330; Digikey Part #: 13-CC0402KRNPO9BN330CT-ND; JLCPCB Part #: C107005
D1-D8 = D-LED-GREEN-2V-20mA-0603: as D36 on sheet Microcontroller (MCU); Mounting Type: SMT; Mouser Part #: 859-LTST-C190KGKT; Digikey Part #: 160-1435-1-ND; JLCPCB Part #: C125094
J1-J8 = J-02-2P54-HDR-M-VERT-TH: Male straight header, 1 row, 2 positions, 2.54mm pitch, through-hole; Part Number: 10129378-902001BLF; Manufacturer: Amphenol FCI; Mounting Type: THT; Mouser Part #: 649-1012937890201BLF; Digikey Part #: 10129378-902001BLF-ND; JLCPCB Part #: C3324910
J9-J12 = J-02-5P08-TERM-F-VERT-TH: Pluggable Terminal Blocks 2 Pos 5.08mm pitch Through Hole Header; Manufacturer: Adam Tech; Part Number: EBA-02-D-BU-01; Mouser Part #: 737-EBA-02-D-BU-01; Mounting Type: THT; Digikey Part #: ED2609-ND; JLCPCB Part #: C8475
R1 R2 R5-R9 R11 = R-THICK-2K2-125mW-1%-0805: Thick Film Resistors - SMD General Purpose Chip Resistor 0805, 2.2kOhms, 1%, 1/8W; Part Number: RC0805FR-072K2L; Manufacturer: YAGEO; Mounting Type: SMT; Mouser Part #: 603-RC0805FR-072K2L; Digikey Part #: 311-2.20KCRCT-ND; JLCPCB Part #: C114561
R3 = R-THICK-1K-125mW-1%-0805: Thick Film Resistors - SMD General Purpose Chip Resistor 0805, 1kOhms, 1%, 1/8W; Part Number: RC0805FR-071KL; Manufacturer: YAGEO; Mounting Type: SMT; Mouser Part #: 603-RC0805FR-071KL; Digikey Part #: 311-1.00KCRCT-ND; JLCPCB Part #: C95781
R4 = R-THICK-51K-62.5mW-1%-0402: Thick Film Resistors - SMD General Purpose Chip Resistor 0402, 51kOhms, 1%, 1/16W; Part Number: RC0402FR-0751KL; Manufacturer: YAGEO; Mounting Type: SMT; Mouser Part #: 603-RC0402FR-0751KL; Digikey Part #: 311-51.0KLRCT-ND; JLCPCB Part #: C107229
R10 = R-THICK-15K-62.5mW-1%-0402: Thick Film Resistors - SMD General Purpose Chip Resistor 0402, 15kOhms, 1%, 1/16W; Part Number: RC0402FR-0715KL; Manufacturer: YAGEO; Mounting Type: SMT; Mouser Part #: 603-RC0402FR-0715KL; Digikey Part #: 311-15.0KLRCT-ND; JLCPCB Part #: C114761
R12 = R-THICK-1M-125mW-1%-0805: Thick Film Resistors - SMD General Purpose Chip Resistor 0805, 1MOhms, 1%, 1/8W; Part Number: RC0805FR-071ML; Manufacturer: YAGEO; Mounting Type: SMT; Mouser Part #: 603-RC0805FR-071ML; Digikey Part #: 311-1.00MCRCT-ND; JLCPCB Part #: C107700
R13 = R-THICK-82K-125mW-1%-0805: Thick Film Resistors - SMD General Purpose Chip Resistor 0805, 82 kOhms, 1%, 1/8W; Part Number: RC0805FR-0782KL; Manufacturer: YAGEO; Mounting Type: SMT; Mouser Part #: 603-RC0805FR-0782KL; Digikey Part #: 311-82.0KCRCT-ND; JLCPCB Part #: C137489
R14-R17 = R-THICK-220R-62.5mW-1%-0402: Thick Film Resistors - SMD General Purpose Chip Resistor 0402, 220Ohms, 1%, 1/16W; Part Number: RC0402FR-07220RL; Manufacturer: YAGEO; Mounting Type: SMT; Mouser Part #: 603-RC0402FR-07220RL; Digikey Part #: 311-220LRCT-ND; JLCPCB Part #: C112291
R80-R83 = R-THICK-0R-62.5mW-1%-0402: Thick Film Resistors - SMD General Purpose Chip Resistor 0402, 0Ohms, 1%, 1/16W; Part Number: RC0402FR-070RL; Manufacturer: YAGEO; Mounting Type: SMT; Mouser Part #: 603-RC0402FR-070RL; Digikey Part #: 311-0.0LRCT-ND; JLCPCB Part #: C106231
TP7 = TP-1MM-SMD: Test point, 1mm, exposed pad; Mounting Type: SMD; JLCPCB Part #: C5199810
U1 = U-SCLT3-8BT8: I/O Controller Interface IC 8-Line Protected Digital Serial; Manufacturer: STMicroelectronics; Mounting Type: SMT; Mouser Part #: 511-SCLT3-8BT8; Digikey Part #: 497-10100-5-ND; JLCPCB Part #: C1519056

## Sheet Digital Output (DOUT).SchDoc
size A4; SheetNumber: 6; SheetTotal: 10
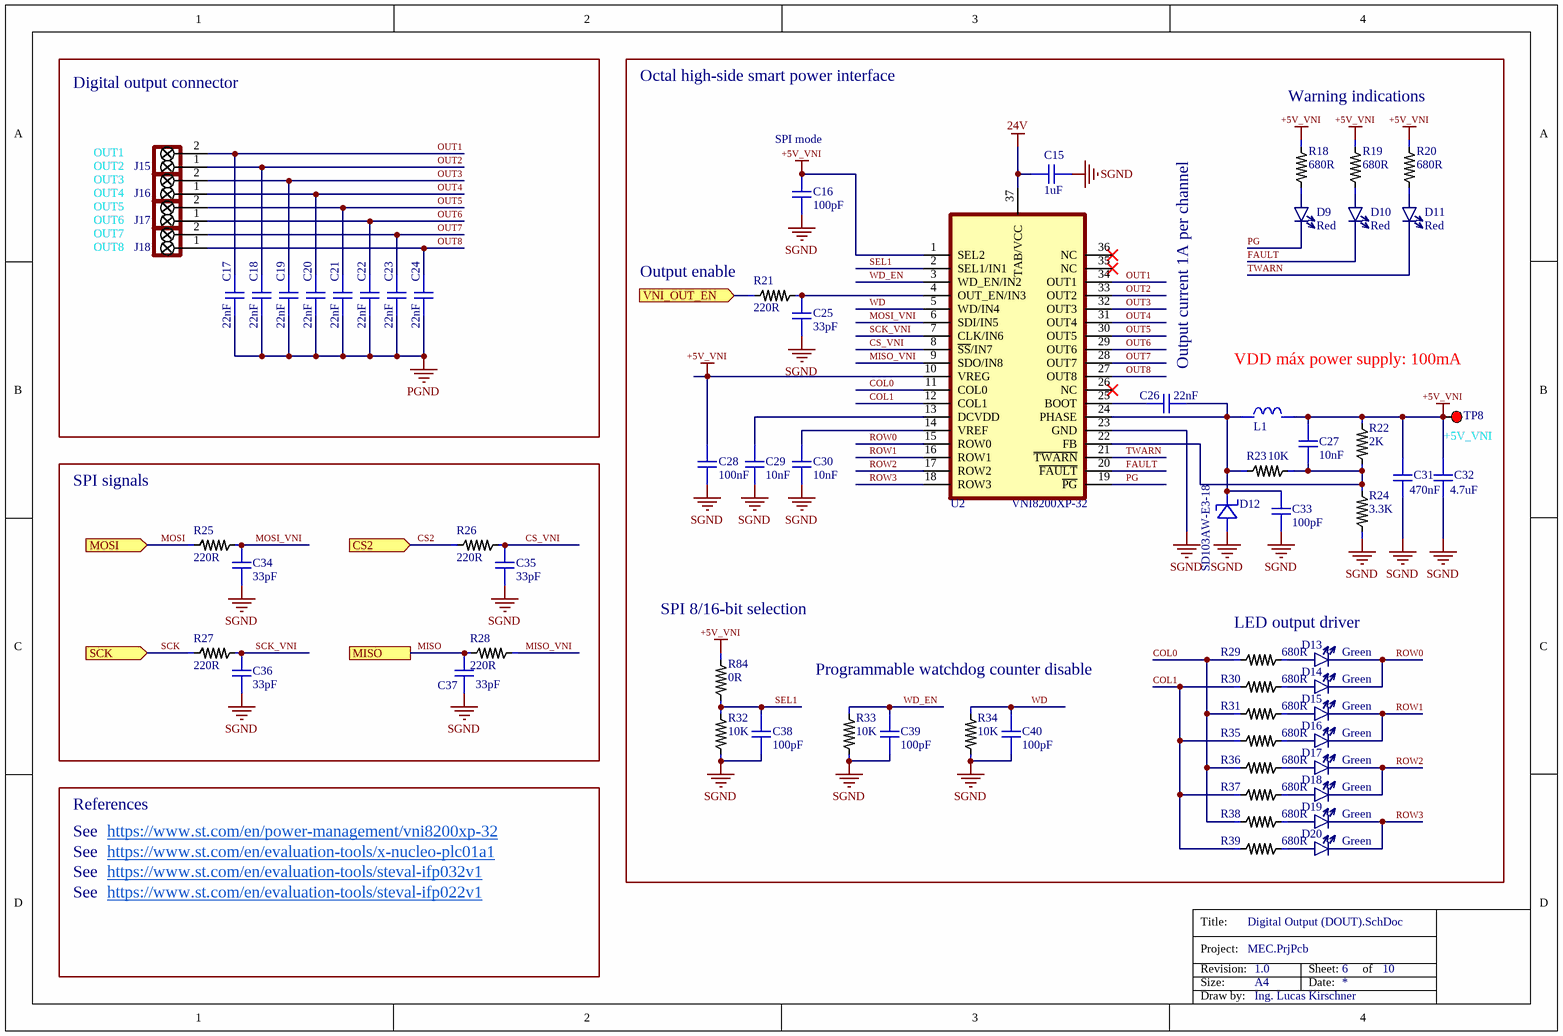
[diagram p4: Digital Output (DOUT).SchDoc]

### Parts
C15  value 1uF  [CAPC1005N]  (hidden comment: Multilayer Ceramic Capacitors)
C16  value 100pF  [CAPC1005N]  (hidden comment: Multilayer Ceramic Capacitors)
C17  value 22nF  [CAPC2012N]  (hidden comment: Multilayer Ceramic Capacitors)
C18  value 22nF  [CAPC2012N]  (hidden comment: Multilayer Ceramic Capacitors)
C19  value 22nF  [CAPC2012N]  (hidden comment: Multilayer Ceramic Capacitors)
C20  value 22nF  [CAPC2012N]  (hidden comment: Multilayer Ceramic Capacitors)
C21  value 22nF  [CAPC2012N]  (hidden comment: Multilayer Ceramic Capacitors)
C22  value 22nF  [CAPC2012N]  (hidden comment: Multilayer Ceramic Capacitors)
C23  value 22nF  [CAPC2012N]  (hidden comment: Multilayer Ceramic Capacitors)
C24  value 22nF  [CAPC2012N]  (hidden comment: Multilayer Ceramic Capacitors)
C25  value 33pF  [CAPC1005N]  (hidden comment: Multilayer Ceramic Capacitors)
C26  value 22nF  [CAPC1005N]  (hidden comment: Multilayer Ceramic Capacitors)
C27  value 10nF  [CAPC1005N]  (hidden comment: Multilayer Ceramic Capacitors)
C28  value 100nF  [CAPC1005N]  (hidden comment: Multilayer Ceramic Capacitors)
C29  value 10nF  [CAPC1005N]  (hidden comment: Multilayer Ceramic Capacitors)
C30  value 10nF  [CAPC1005N]  (hidden comment: Multilayer Ceramic Capacitors)
C31  value 470nF  [CAPC1005N]  (hidden comment: Multilayer Ceramic Capacitors)
C32  value 4.7uF  [CAPC1005N]  (hidden comment: Multilayer Ceramic Capacitors)
C33  value 100pF  [CAPC1005N]  (hidden comment: Multilayer Ceramic Capacitors)
C34  value 33pF  [CAPC1005N]  (hidden comment: Multilayer Ceramic Capacitors)
C35  value 33pF  [CAPC1005N]  (hidden comment: Multilayer Ceramic Capacitors)
C36  value 33pF  [CAPC1005N]  (hidden comment: Multilayer Ceramic Capacitors)
C37  value 33pF  [CAPC1005N]  (hidden comment: Multilayer Ceramic Capacitors)
C38  value 100pF  [CAPC1005N]  (hidden comment: Multilayer Ceramic Capacitors)
C39  value 100pF  [CAPC1005N]  (hidden comment: Multilayer Ceramic Capacitors)
C40  value 100pF  [CAPC1005N]  (hidden comment: Multilayer Ceramic Capacitors)
D9  value Red  [LEDC1608X80N_RED]  (hidden comment: Single Color LED)
D10  value Red  [LEDC1608X80N_RED]  (hidden comment: Single Color LED)
D11  value Red  [LEDC1608X80N_RED]  (hidden comment: Single Color LED)
D12  Part Number: SD103AW-E3-18  [SOD3705X110-2N]  (hidden comment: Schottky Diodes)
D13  value Green  [LEDC1608X80N_GREEN]  (hidden comment: Single Color LED)
D14  value Green  [LEDC1608X80N_GREEN]  (hidden comment: Single Color LED)
D15  value Green  [LEDC1608X80N_GREEN]  (hidden comment: Single Color LED)
D16  value Green  [LEDC1608X80N_GREEN]  (hidden comment: Single Color LED)
D17  value Green  [LEDC1608X80N_GREEN]  (hidden comment: Single Color LED)
D18  value Green  [LEDC1608X80N_GREEN]  (hidden comment: Single Color LED)
D19  value Green  [LEDC1608X80N_GREEN]  (hidden comment: Single Color LED)
D20  value Green  [LEDC1608X80N_GREEN]  (hidden comment: Single Color LED)
J15  Terminal Blocks  [CONB_FIX508P-2N]  (value not drawn)
J16  Terminal Blocks  [CONB_FIX508P-2N]  (value not drawn)
J17  Terminal Blocks  [CONB_FIX508P-2N]  (value not drawn)
J18  Terminal Blocks  [CONB_FIX508P-2N]  (value not drawn)
L1  Power Inductor  [INDP4018220N]  (value not drawn)
R18  value 680R  [RESC1005N]  (hidden comment: Thick Film Resistors)
R19  value 680R  [RESC1005N]  (hidden comment: Thick Film Resistors)
R20  value 680R  [RESC1005N]  (hidden comment: Thick Film Resistors)
R21  value 220R  [RESC1005N]  (hidden comment: Thick Film Resistors)
R22  value 2K  [RESC1608N]  (hidden comment: Thick Film Resistors)
R23  value 10K  [RESC1608N]  (hidden comment: Thick Film Resistors)
R24  value 3.3K  [RESC1608N]  (hidden comment: Thick Film Resistors)
R25  value 220R  [RESC1005N]  (hidden comment: Thick Film Resistors)
R26  value 220R  [RESC1005N]  (hidden comment: Thick Film Resistors)
R27  value 220R  [RESC1005N]  (hidden comment: Thick Film Resistors)
R28  value 220R  [RESC1005N]  (hidden comment: Thick Film Resistors)
R29  value 680R  [RESC1005N]  (hidden comment: Thick Film Resistors)
R30  value 680R  [RESC1005N]  (hidden comment: Thick Film Resistors)
R31  value 680R  [RESC1005N]  (hidden comment: Thick Film Resistors)
R32  value 10K  [RESC1005N]  (hidden comment: Thick Film Resistors)
R33  value 10K  [RESC1005N]  (hidden comment: Thick Film Resistors)
R34  value 10K  [RESC1005N]  (hidden comment: Thick Film Resistors)
R35  value 680R  [RESC1005N]  (hidden comment: Thick Film Resistors)
R36  value 680R  [RESC1005N]  (hidden comment: Thick Film Resistors)
R37  value 680R  [RESC1005N]  (hidden comment: Thick Film Resistors)
R38  value 680R  [RESC1005N]  (hidden comment: Thick Film Resistors)
R39  value 680R  [RESC1005N]  (hidden comment: Thick Film Resistors)
R84  value 0R  [RESC1005N]  (hidden comment: Thick Film Resistors)
TP8  Test point  [TP-1MM]  (value not drawn)  (no BOM)
U2  Part Number: VNI8200XP-32  [SOP50P1030X245-37N]  (hidden comment: Power Switch ICs)

### Blocks framed on the sheet
Digital output connector: C17-C24 J15-J18
SPI signals: C34-C37 R25-R28

### Ports
CS2 (in, see Main[3C], Microcontroller (MCU)[4C]), MISO (see Main[3C], Digital Input (DIN)[1C], Microcontroller (MCU)[4C]), MOSI (in, see Main[3C], Digital Input (DIN)[1C], Microcontroller (MCU)[4C]), SCK (in, see Main[3C], Digital Input (DIN)[1C], Microcontroller (MCU)[4C]), VNI_OUT_EN (in, see Main[3C], Microcontroller (MCU)[4C])

### Nets
24V: C15.1 U2.37(TAB/VCC)
+5V_VNI: C16.1 C27.1 C28.1 C31.1 C32.1 L1.2 R18.2 R19.2 R20.2 R22.2 R84.2 TP8.1 U2.1(SEL2) U2.10(VREG)
PGND: C17.2 C18.2 C19.2 C20.2 C21.2 C22.2 C23.2 C24.2
SGND: C15.2 C16.2 C25.2 C28.2 C29.2 C30.2 C31.2 C32.2 C33.2 C34.2 C35.2 C36.2 C37.2 C38.2 C39.2 C40.2 D12.A R24.1 R32.1 R33.1 R34.1 U2.23(GND)
COL0: R29.2 R31.2 R36.2 R38.2 U2.11(COL0)
COL1: R30.2 R35.2 R37.2 R39.2 U2.12(COL1)
CS2: R26.1 ; port CS2
CS_VNI: C35.1 R26.2 U2.8(~{SS}/IN7)
FAULT: D10.C U2.20(~{FAULT})
MISO: C37.1 R28.1 ; port MISO
MISO_VNI: R28.2 U2.9(SDO/IN8)
MOSI: R25.1 ; port MOSI
MOSI_VNI: C34.1 R25.2 U2.6(SDI/IN5)
OUT1: C17.1 J15.2 U2.34(OUT1)
OUT2: C18.1 J15.1 U2.33(OUT2)
OUT3: C19.1 J16.2 U2.32(OUT3)
OUT4: C20.1 J16.1 U2.31(OUT4)
OUT5: C21.1 J17.2 U2.30(OUT5)
OUT6: C22.1 J17.1 U2.29(OUT6)
OUT7: C23.1 J18.2 U2.28(OUT7)
OUT8: C24.1 J18.1 U2.27(OUT8)
PG: D9.C U2.19(~{PG})
ROW0: D13.C D14.C U2.15(ROW0)
ROW1: D15.C D16.C U2.16(ROW1)
ROW2: D17.C D18.C U2.17(ROW2)
ROW3: D19.C D20.C U2.18(ROW3)
SCK: R27.1 ; port SCK
SCK_VNI: C36.1 R27.2 U2.7(CLK/IN6)
SEL1: C38.1 R32.2 R84.1 U2.2(SEL1/IN1)
TWARN: D11.C U2.21(~{TWARN})
VNI_OUT_EN: R21.1 ; port VNI_OUT_EN
WD: C40.1 R34.2 U2.5(WD/IN4)
WD_EN: C39.1 R33.2 U2.3(WD_EN/IN2)
NetC25_1: C25.1 R21.2 U2.4(OUT_EN/IN3)
NetC26_1: C26.1 U2.25(BOOT)
NetC26_2: C26.2 C33.1 D12.C L1.1 R23.1 U2.24(PHASE)
NetC27_2: C27.2 R22.1 R23.2 R24.2 U2.22(FB)
NetC29_1: C29.1 U2.13(DCVDD)
NetC30_1: C30.1 U2.14(VREF)
NetD9_A: D9.A R18.1
NetD10_A: D10.A R19.1
NetD11_A: D11.A R20.1
NetD13_A: D13.A R29.1
NetD14_A: D14.A R30.1
NetD15_A: D15.A R31.1
NetD16_A: D16.A R35.1
NetD17_A: D17.A R36.1
NetD18_A: D18.A R37.1
NetD19_A: D19.A R38.1
NetD20_A: D20.A R39.1

Not connected (* = marked no-connect by the designer): U2 26(NC)* 35(NC)* 36(NC)*

### Notes on the sheet
- Octal high-side smart power interface
- Warning indications
- OUT1
- OUT2
- (near C16) SPI mode
- OUT3
- OUT4
- OUT5
- OUT6
- OUT7
- OUT8
- (near R21) Output enable
- (near C26) Output current 1A per channel
- VDD máx power supply: 100mA
- (near TP8) +5V_VNI
- (near R84) SPI 8/16-bit selection
- LED output driver
- Programmable watchdog counter disable
- References
- See
- https://www.st.com/en/power-management/vni8200xp-32
- https://www.st.com/en/evaluation-tools/x-nucleo-plc01a1
- https://www.st.com/en/evaluation-tools/steval-ifp032v1
- https://www.st.com/en/evaluation-tools/steval-ifp022v1
- Title:
- Project:
- Revision:
- Size:
- A4
- Sheet:
- Date:
- of
- Draw by:

### Library data of the parts
C15 = C-MLCC-1uF-50V-10%-0402: Multilayer Ceramic Capacitors MLCC - SMD/SMT 50V 1uF X5R 0402 10% HI CV; Part Number: CC0402KRX5R9BB105; Manufacturer: YAGEO; Mounting Type: SMT; Mouser Part #: 603-CC0402KX5R9BB105; Digikey Part #: 13-CC0402KRX5R9BB105CT-ND; JLCPCB Part #: C7500380
C16 C33 C38-C40 = C-MLCC-100pF-50V-10%-0402: Multilayer Ceramic Capacitors MLCC - SMD/SMT 50 V 100pF X7R 0402 10%; Part Number: CC0402KRX7R9BB101; Manufacturer: YAGEO; Mounting Type: SMT; Mouser Part #: 603-CC402KRX7R9BB101; Digikey Part #: 311-1419-1-ND; JLCPCB Part #: C281751
C17-C24 = C-MLCC-22nF-100V-10%-0805: as C1 on sheet Digital Input (DIN); Mounting Type: SMT; Mouser Part #: 603-CC805KRX7R0BB223; Digikey Part #: 311-1473-1-ND; JLCPCB Part #: C107137
C25 C34-C37 = C-MLCC-33pF-50V-10%-0402: as C11 on sheet Digital Input (DIN); Mounting Type: SMT; Mouser Part #: 603-CC0402KRNP9BN330; Digikey Part #: 13-CC0402KRNPO9BN330CT-ND; JLCPCB Part #: C107005
C26 = C-MLCC-22nF-50V-10%-0402: Multilayer Ceramic Capacitors MLCC - SMD/SMT 50 V 0.022uF X7R 0402 10%; Part Number: CC0402KRX7R9BB223; Manufacturer: YAGEO; Mounting Type: SMT; Mouser Part #: 603-CC402KRX7R9BB223; Digikey Part #: 311-1722-1-ND; JLCPCB Part #: C107026
C27 C29 C30 = C-MLCC-10nF-50V-10%-0402: Multilayer Ceramic Capacitors MLCC - SMD/SMT 50 V 0.01uF X7R 0402 10%; Part Number: CC0402KRX7R9BB103; Manufacturer: YAGEO; Mounting Type: SMT; Mouser Part #: 603-CC402KRX7R9BB103; Digikey Part #: 311-1349-1-ND; JLCPCB Part #: C60133
C28 = C-MLCC-100nF-50V-10%-0402: as C64 on sheet Microcontroller (MCU); Mounting Type: SMT; Mouser Part #: 603-CC402KRX5R9BB104; Digikey Part #: 311-3342-1-ND; JLCPCB Part #: C105882
C31 = C-MLCC-470nF-50V-10%-0402: Multilayer Ceramic Capacitors MLCC - SMD/SMT 50 V 0.470uF X7R 0402 10%; Part Number: CC0402KRX5R9BB474; Manufacturer: YAGEO; Mounting Type: SMT; Mouser Part #: 603-CC0402KRX59BB474; Digikey Part #: 13-CC0402KRX5R9BB474CT-ND; JLCPCB Part #: C513552
C32 = C-MLCC-4.7uF-10V-10%-0402: as C71 on sheet Microcontroller (MCU); Mounting Type: SMT; Mouser Part #: 603-CC0402KR5R6BB475; Digikey Part #: 13-CC0402KRX5R6BB475CT-ND; JLCPCB Part #: C326586
D9-D11 = D-LED-RED-2V-20mA-0603: as D34 on sheet Microcontroller (MCU); Mounting Type: SMT; Mouser Part #: 859-LTST-C190KRKT; Digikey Part #: 160-1436-1-ND; JLCPCB Part #: C94869
D12 = D-SCH-350mA-40V-SOD123: as D28 on sheet Microcontroller (MCU); Mounting Type: SMT; Mouser Part #: 78-SD103AW-E3-18; Digikey Part #: SD103AW-E3-18CT-ND; JLCPCB Part #: C181204
D13-D20 = D-LED-GREEN-2V-20mA-0603: as D36 on sheet Microcontroller (MCU); Mounting Type: SMT; Mouser Part #: 859-LTST-C190KGKT; Digikey Part #: 160-1435-1-ND; JLCPCB Part #: C125094
J15-J18 = J-02-5P08-TERM-F-VERT-TH: as J9 on sheet Digital Input (DIN); Mouser Part #: 737-EBA-02-D-BU-01; Mounting Type: THT; Digikey Part #: ED2609-ND; JLCPCB Part #: C8475
L1 = L-PWR-100uH-0.42A-SMT: Power Inductors - SMD 100uH 0.42A 1.6Ohms; Manufacturer: Bourns; Part Number: SRN4018-101M; Value: 100uH; Mounting Type: SMT; Mouser Part #: 652-SRN4018-101M; Digikey Part #: SRN4018-101MCT-ND; JLCPCB Part #: C83471
R18-R20 R29-R31 R35-R39 = R-THICK-680R-62.5mW-1%-0402: Thick Film Resistors - SMD General Purpose Chip Resistor 0402, 680Ohms, 1%, 1/16W; Part Number: RC0402FR-07680RL; Manufacturer: YAGEO; Mounting Type: SMT; Mouser Part #: 603-RC0402FR-07680RL; Digikey Part #: 311-680LRCT-ND; JLCPCB Part #: C137948
R21 R25-R28 = R-THICK-220R-62.5mW-1%-0402: as R14 on sheet Digital Input (DIN); Mounting Type: SMT; Mouser Part #: 603-RC0402FR-07220RL; Digikey Part #: 311-220LRCT-ND; JLCPCB Part #: C112291
R22 = R-THICK-2K-100mW-1%-0603: Thick Film Resistors - SMD General Purpose Chip Resistor 0603, 2kOhms, 1%, 1/10W; Part Number: RC0603FR-072KL; Manufacturer: YAGEO; Mounting Type: SMT; Mouser Part #: 603-RC0603FR-072KL; Digikey Part #: 311-2.00KHRCT-ND; JLCPCB Part #: C105576
R23 = R-THICK-10K-100mW-1%-0603: Thick Film Resistors - SMD General Purpose Chip Resistor 0603, 10kOhms, 1%, 1/10W; Part Number: RC0603FR-0710KL; Manufacturer: YAGEO; Mounting Type: SMT; Mouser Part #: 603-RC0603FR-0710KL; Digikey Part #: 311-10.0KHRCT-ND; JLCPCB Part #: C98220
R24 = R-THICK-3K3-100mW-1%-0603: Thick Film Resistors - SMD General Purpose Chip Resistor 0603, 3.3kOhms, 1%, 1/10W; Part Number: RC0603FR-073K3L; Manufacturer: YAGEO; Mounting Type: SMT; Mouser Part #: 603-RC0603FR-073K3L; Digikey Part #: 311-3.30KHRCT-ND; JLCPCB Part #: C108078
R32-R34 = R-THICK-10K-62.5mW-1%-0402: as R79 on sheet Microcontroller (MCU); Mounting Type: SMT; Mouser Part #: 603-RC0402FR-0710KL; Digikey Part #: 311-10.0KLRCT-ND; JLCPCB Part #: C60490
R84 = R-THICK-0R-62.5mW-1%-0402: as R80 on sheet Digital Input (DIN); Mounting Type: SMT; Mouser Part #: 603-RC0402FR-070RL; Digikey Part #: 311-0.0LRCT-ND; JLCPCB Part #: C106231
TP8 = TP-1MM-SMD: Test point, 1mm, exposed pad; Mounting Type: SMD; JLCPCB Part #: C5199810
U2 = U-VNI8200XP-32: Power Switch ICs - Power Distribution 8-Ch Octal HS SSR 100mA VIPower; Manufacturer: STMicroelectronics; Mounting Type: SMT; Mouser Part #: 511-VNI8200XP-32; Digikey Part #: 497-VNI8200XP-32-ND; JLCPCB Part #: C1556834